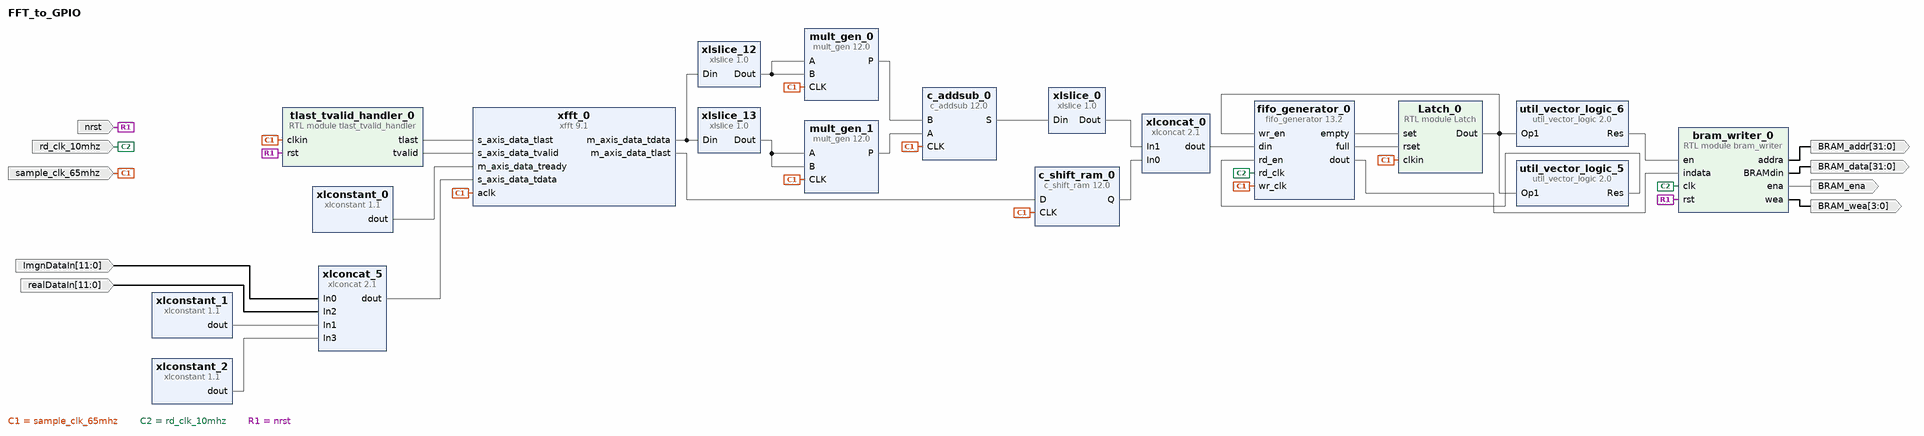
[diagram p0: block diagram of the top level]
# Vivado block design FFT_to_GPIO, xczu3eg-sfvc784-1-e, Vivado 2023.1
create_bd_design FFT_to_GPIO

create_bd_port -dir I -type clk rd_clk_10mhz
create_bd_port -dir I -type rst nrst
create_bd_port -dir I -type clk sample_clk_65mhz
set_property -dict {CONFIG.FREQ_HZ 65000000} [get_bd_ports sample_clk_65mhz]
create_bd_port -dir I -from 11 -to 0 realDataIn
create_bd_port -dir I -from 11 -to 0 ImgnDataIn
create_bd_port -dir O -from 31 -to 0 BRAM_addr
create_bd_port -dir O BRAM_ena
create_bd_port -dir O -from 3 -to 0 BRAM_wea
create_bd_port -dir O -from 31 -to 0 BRAM_data

create_bd_cell -type ip -vlnv xilinx.com:ip:xlconcat:2.1 xlconcat_5
set_property -dict [list \
  CONFIG.IN0_WIDTH 12 \
  CONFIG.IN1_WIDTH 4 \
  CONFIG.IN2_WIDTH 12 \
  CONFIG.IN3_WIDTH 4 \
  CONFIG.NUM_PORTS 4 \
] [get_bd_cells xlconcat_5]
create_bd_cell -type ip -vlnv xilinx.com:ip:xlslice:1.0 xlslice_12
set_property -dict {CONFIG.DIN_FROM 27 CONFIG.DIN_TO 16} [get_bd_cells xlslice_12]
create_bd_cell -type ip -vlnv xilinx.com:ip:xlslice:1.0 xlslice_13
set_property -dict {CONFIG.DIN_FROM 11 CONFIG.DIN_TO 0} [get_bd_cells xlslice_13]
create_bd_cell -type ip -vlnv xilinx.com:ip:util_vector_logic:2.0 util_vector_logic_5
set_property -dict {CONFIG.C_OPERATION not CONFIG.C_SIZE 1} [get_bd_cells util_vector_logic_5]
create_bd_cell -type ip -vlnv xilinx.com:ip:xlconstant:1.1 xlconstant_0
create_bd_cell -type ip -vlnv xilinx.com:ip:xlconcat:2.1 xlconcat_0
set_property -dict {CONFIG.IN0_WIDTH 1 CONFIG.IN1_WIDTH 23} [get_bd_cells xlconcat_0]
create_bd_cell -type ip -vlnv xilinx.com:ip:xlslice:1.0 xlslice_0
set_property -dict {CONFIG.DIN_FROM 23 CONFIG.DIN_TO 1 CONFIG.DIN_WIDTH 24} [get_bd_cells xlslice_0]
create_bd_cell -type module -reference tlast_tvalid_handler tlast_tvalid_handler_0
set_property -dict {CONFIG.numSamples 128} [get_bd_cells tlast_tvalid_handler_0]
create_bd_cell -type ip -vlnv xilinx.com:ip:xlconstant:1.1 xlconstant_1
set_property -dict {CONFIG.CONST_VAL 0 CONFIG.CONST_WIDTH 4} [get_bd_cells xlconstant_1]
create_bd_cell -type ip -vlnv xilinx.com:ip:xlconstant:1.1 xlconstant_2
set_property -dict {CONFIG.CONST_VAL 0 CONFIG.CONST_WIDTH 4} [get_bd_cells xlconstant_2]
create_bd_cell -type ip -vlnv xilinx.com:ip:util_vector_logic:2.0 util_vector_logic_6
set_property -dict {CONFIG.C_OPERATION not CONFIG.C_SIZE 1} [get_bd_cells util_vector_logic_6]
create_bd_cell -type module -reference Latch Latch_0
create_bd_cell -type module -reference bram_writer bram_writer_0
create_bd_cell -type ip -vlnv xilinx.com:ip:c_addsub:12.0 c_addsub_0
set_property -dict [list \
  CONFIG.A_Type Signed \
  CONFIG.A_Width 24 \
  CONFIG.B_Type Signed \
  CONFIG.B_Value 000000000000000000000000 \
  CONFIG.B_Width 24 \
  CONFIG.CE false \
  CONFIG.Latency 1 \
  CONFIG.Out_Width 24 \
] [get_bd_cells c_addsub_0]
create_bd_cell -type ip -vlnv xilinx.com:ip:c_shift_ram:12.0 c_shift_ram_0
set_property -dict [list \
  CONFIG.AsyncInitVal 0 \
  CONFIG.DefaultData 0 \
  CONFIG.Depth 2 \
  CONFIG.SCLR false \
  CONFIG.SSET false \
  CONFIG.Width 1 \
] [get_bd_cells c_shift_ram_0]
create_bd_cell -type ip -vlnv xilinx.com:ip:fifo_generator:13.2 fifo_generator_0
set_property -dict [list \
  CONFIG.Enable_ECC false \
  CONFIG.Fifo_Implementation Independent_Clocks_Builtin_FIFO \
  CONFIG.Input_Data_Width 24 \
  CONFIG.Input_Depth 512 \
  CONFIG.Performance_Options Standard_FIFO \
  CONFIG.Read_Clock_Frequency 10 \
  CONFIG.Write_Clock_Frequency 65 \
  CONFIG.asymmetric_port_width false \
] [get_bd_cells fifo_generator_0]
create_bd_cell -type ip -vlnv xilinx.com:ip:mult_gen:12.0 mult_gen_0
set_property -dict [list \
  CONFIG.PortAType Signed \
  CONFIG.PortAWidth 12 \
  CONFIG.PortBType Signed \
  CONFIG.PortBWidth 12 \
] [get_bd_cells mult_gen_0]
create_bd_cell -type ip -vlnv xilinx.com:ip:mult_gen:12.0 mult_gen_1
set_property -dict [list \
  CONFIG.PortAType Signed \
  CONFIG.PortAWidth 12 \
  CONFIG.PortBType Signed \
  CONFIG.PortBWidth 12 \
] [get_bd_cells mult_gen_1]
create_bd_cell -type ip -vlnv xilinx.com:ip:xfft:9.1 xfft_0
set_property -dict [list \
  CONFIG.channels 1 \
  CONFIG.implementation_options automatically_select \
  CONFIG.input_width 12 \
  CONFIG.number_of_stages_using_block_ram_for_data_and_phase_factors 0 \
  CONFIG.output_ordering natural_order \
  CONFIG.phase_factor_width 16 \
  CONFIG.scaling_options scaled \
  CONFIG.target_clock_frequency 65 \
  CONFIG.target_data_throughput 65 \
  CONFIG.transform_length 128 \
] [get_bd_cells xfft_0]

# ---- connections ----

connect_bd_net [get_bd_ports ImgnDataIn] [get_bd_pins xlconcat_5/In0]
connect_bd_net -net Latch_0_output [get_bd_pins Latch_0/Dout] \
  [get_bd_pins util_vector_logic_5/Op1] [get_bd_pins util_vector_logic_6/Op1] [get_bd_pins fifo_generator_0/wr_en]
connect_bd_net [get_bd_pins xfft_0/m_axis_data_tdata] [get_bd_pins xlslice_12/Din] [get_bd_pins xlslice_13/Din]
connect_bd_net [get_bd_pins xlslice_12/Dout] [get_bd_pins mult_gen_0/A] [get_bd_pins mult_gen_0/B]
connect_bd_net [get_bd_pins xlslice_13/Dout] [get_bd_pins mult_gen_1/A] [get_bd_pins mult_gen_1/B]
connect_bd_net [get_bd_pins bram_writer_0/BRAMdin] [get_bd_ports BRAM_data]
connect_bd_net [get_bd_pins bram_writer_0/addra] [get_bd_ports BRAM_addr]
connect_bd_net [get_bd_pins bram_writer_0/ena] [get_bd_ports BRAM_ena]
connect_bd_net [get_bd_pins bram_writer_0/wea] [get_bd_ports BRAM_wea]
connect_bd_net [get_bd_pins c_addsub_0/S] [get_bd_pins xlslice_0/Din]
connect_bd_net [get_bd_pins c_shift_ram_0/Q] [get_bd_pins xlconcat_0/In0]
connect_bd_net -net clkin_0_1 [get_bd_ports sample_clk_65mhz] \
  [get_bd_pins tlast_tvalid_handler_0/clkin] [get_bd_pins Latch_0/clkin] [get_bd_pins c_addsub_0/CLK] \
  [get_bd_pins c_shift_ram_0/CLK] [get_bd_pins fifo_generator_0/wr_clk] [get_bd_pins mult_gen_0/CLK] \
  [get_bd_pins mult_gen_1/CLK] [get_bd_pins xfft_0/aclk]
connect_bd_net [get_bd_pins fifo_generator_0/dout] [get_bd_pins bram_writer_0/indata]
connect_bd_net [get_bd_pins fifo_generator_0/empty] [get_bd_pins Latch_0/set]
connect_bd_net [get_bd_pins fifo_generator_0/full] [get_bd_pins Latch_0/rset]
connect_bd_net [get_bd_pins mult_gen_0/P] [get_bd_pins c_addsub_0/B]
connect_bd_net [get_bd_pins mult_gen_1/P] [get_bd_pins c_addsub_0/A]
connect_bd_net -net rd_clk_0_1 [get_bd_ports rd_clk_10mhz] [get_bd_pins bram_writer_0/clk] [get_bd_pins fifo_generator_0/rd_clk]
connect_bd_net [get_bd_ports realDataIn] [get_bd_pins xlconcat_5/In2]
connect_bd_net -net rst_0_1 [get_bd_ports nrst] [get_bd_pins tlast_tvalid_handler_0/rst] [get_bd_pins bram_writer_0/rst]
connect_bd_net [get_bd_pins tlast_tvalid_handler_0/tlast] [get_bd_pins xfft_0/s_axis_data_tlast]
connect_bd_net [get_bd_pins tlast_tvalid_handler_0/tvalid] [get_bd_pins xfft_0/s_axis_data_tvalid]
connect_bd_net [get_bd_pins util_vector_logic_5/Res] [get_bd_pins fifo_generator_0/rd_en]
connect_bd_net [get_bd_pins util_vector_logic_6/Res] [get_bd_pins bram_writer_0/en]
connect_bd_net [get_bd_pins xfft_0/m_axis_data_tlast] [get_bd_pins c_shift_ram_0/D]
connect_bd_net [get_bd_pins xlconcat_0/dout] [get_bd_pins fifo_generator_0/din]
connect_bd_net [get_bd_pins xlconcat_5/dout] [get_bd_pins xfft_0/s_axis_data_tdata]
connect_bd_net [get_bd_pins xlconstant_0/dout] [get_bd_pins xfft_0/m_axis_data_tready]
connect_bd_net [get_bd_pins xlconstant_1/dout] [get_bd_pins xlconcat_5/In1]
connect_bd_net [get_bd_pins xlconstant_2/dout] [get_bd_pins xlconcat_5/In3]
connect_bd_net [get_bd_pins xlslice_0/Dout] [get_bd_pins xlconcat_0/In1]

validate_bd_design
save_bd_design
